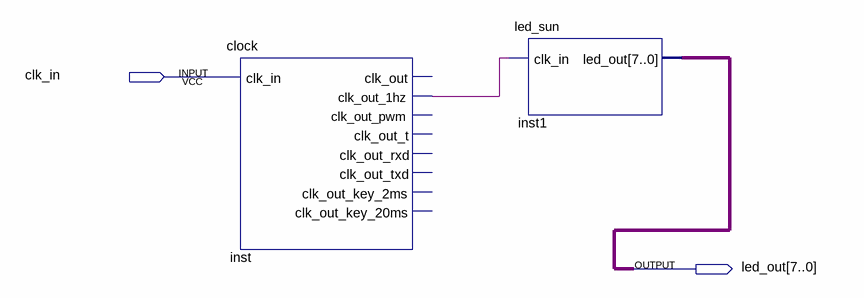
[diagram p0: schematic sheet]
// Quartus schematic led_sun_bdf.bdf as structural Verilog: 2 symbols, 2 pins
module led_sun_bdf (
  input  clk_in,
  output [7:0] led_out
);

  wire inst_clk_out_1hz;

  clock inst (
    .clk_in(clk_in), .clk_out_1hz(inst_clk_out_1hz));  // open: clk_out, clk_out_pwm, clk_out_t, clk_out_rxd, clk_out_txd, clk_out_key_2ms, clk_out_key_20ms
  led_sun inst1 (.clk_in(inst_clk_out_1hz), .led_out(led_out));
endmodule
